# Altium schematic sheet Power_Board_DRV8323.SchDoc: MC Test Rig Power Board
size A4; Author: Ellen Wang; Organization: Waterloop; Address1: 200 University Ave W; Address2: Engineering 5, 1104; Address3: Waterloo, ON; Address4: N2LO 3G1; Revision: 1.0; SheetNumber: 1; SheetTotal: 2
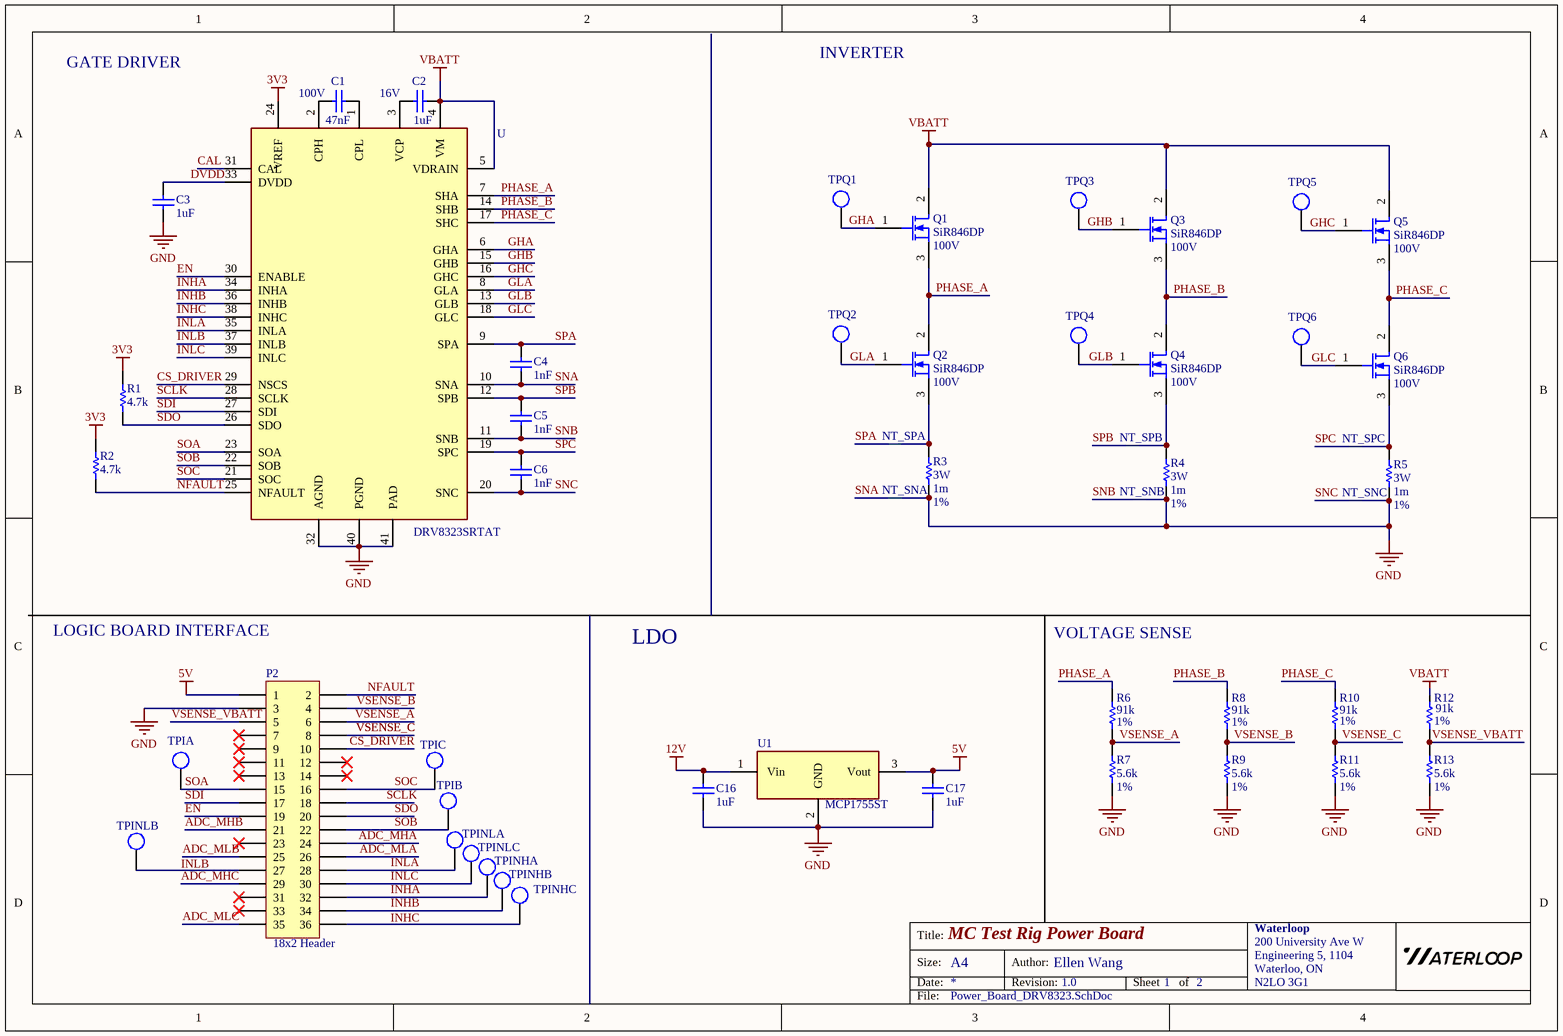
[diagram p0: Power_Board_DRV8323.SchDoc]

## Parts
C1  value 47nF  Rating: 100V  [0805 - Capacitor]  (hidden comment: Capacitor - Nonpolarized)
C2  value 1uF  Rating: 16V  [0805 - Capacitor]  (hidden comment: Capacitor - Nonpolarized)
C3  value 1uF  [0805 - Capacitor]  (hidden comment: Capacitor - Nonpolarized)
C4  value 1nF  [0805 - Capacitor]  (hidden comment: Capacitor - Nonpolarized)
C5  value 1nF  [0805 - Capacitor]  (hidden comment: Capacitor - Nonpolarized)
C6  value 1nF  [0805 - Capacitor]  (hidden comment: Capacitor - Nonpolarized)
C16  value 1uF  [0805 - Capacitor]  (hidden comment: Capacitor - Nonpolarized)
C17  value 1uF  [0805 - Capacitor]  (hidden comment: Capacitor - Nonpolarized)
NT_SNA  NetTie  [Net Tie]  (value not drawn)  (net tie, no BOM)
NT_SNB  NetTie  [Net Tie]  (value not drawn)  (net tie, no BOM)
NT_SNC  NetTie  [Net Tie]  (value not drawn)  (net tie, no BOM)
NT_SPA  NetTie  [Net Tie]  (value not drawn)  (net tie, no BOM)
NT_SPB  NetTie  [Net Tie]  (value not drawn)  (net tie, no BOM)
NT_SPC  NetTie  [Net Tie]  (value not drawn)  (net tie, no BOM)
P2  Header 18X2  [HDR2X18]  (value not drawn)
Q1  Supplier Part Number: SiR846DP  Rating: 100V  [PowerPAK® SO-8]  (hidden comment: MOSFET-N)
Q2  Supplier Part Number: SiR846DP  Rating: 100V  [PowerPAK® SO-8]  (hidden comment: MOSFET-N)
Q3  Supplier Part Number: SiR846DP  Rating: 100V  [PowerPAK® SO-8]  (hidden comment: MOSFET-N)
Q4  Supplier Part Number: SiR846DP  Rating: 100V  [PowerPAK® SO-8]  (hidden comment: MOSFET-N)
Q5  Supplier Part Number: SiR846DP  Rating: 100V  [PowerPAK® SO-8]  (hidden comment: MOSFET-N)
Q6  Supplier Part Number: SiR846DP  Rating: 100V  [PowerPAK® SO-8]  (hidden comment: MOSFET-N)
R1  value 4.7k  [0603 - Resistor]  (hidden comment: Resistor)
R2  value 4.7k  [0603 - Resistor]  (hidden comment: Resistor)
R3  value 1m  Rating: 3W  Tolerance: 1%  [2512 - RESISTOR]  (hidden comment: Resistor)
R4  value 1m  Rating: 3W  Tolerance: 1%  [2512 - RESISTOR]  (hidden comment: Resistor)
R5  value 1m  Rating: 3W  Tolerance: 1%  [2512 - RESISTOR]  (hidden comment: Resistor)
R6  value 91k  Tolerance: 1%  [0603 - Resistor]  (hidden comment: Resistor)
R7  value 5.6k  Tolerance: 1%  [0603 - Resistor]  (hidden comment: Resistor)
R8  value 91k  Tolerance: 1%  [0603 - Resistor]  (hidden comment: Resistor)
R9  value 5.6k  Tolerance: 1%  [0603 - Resistor]  (hidden comment: Resistor)
R10  value 91k  Tolerance: 1%  [0603 - Resistor]  (hidden comment: Resistor)
R11  value 5.6k  Tolerance: 1%  [0603 - Resistor]  (hidden comment: Resistor)
R12  value 91k  Tolerance: 1%  [0603 - Resistor]  (hidden comment: Resistor)
R13  value 5.6k  Tolerance: 1%  [0603 - Resistor]  (hidden comment: Resistor)
TPIA  Test Point  [Test Point]  (value not drawn)  (no BOM)
TPIB  Test Point  [Test Point]  (value not drawn)  (no BOM)
TPIC  Test Point  [Test Point]  (value not drawn)  (no BOM)
TPINHA  Test Point  [Test Point]  (value not drawn)  (no BOM)
TPINHB  Test Point  [Test Point]  (value not drawn)  (no BOM)
TPINHC  Test Point  [Test Point]  (value not drawn)  (no BOM)
TPINLA  Test Point  [Test Point]  (value not drawn)  (no BOM)
TPINLB  Test Point  [Test Point]  (value not drawn)  (no BOM)
TPINLC  Test Point  [Test Point]  (value not drawn)  (no BOM)
TPQ1  Test Point  [Test Point]  (value not drawn)  (no BOM)
TPQ2  Test Point  [Test Point]  (value not drawn)  (no BOM)
TPQ3  Test Point  [Test Point]  (value not drawn)  (no BOM)
TPQ4  Test Point  [Test Point]  (value not drawn)  (no BOM)
TPQ5  Test Point  [Test Point]  (value not drawn)  (no BOM)
TPQ6  Test Point  [Test Point]  (value not drawn)  (no BOM)
U  DRV8323SRTAT  [DRV8323SRTAT]
U1  MCP1755ST  [MCP1755ST]  (value not drawn)

## Nets
3V3: R1.2 R2.2 U.24(VREF)
5V: C17.2 P2.1 U1.3(Vout)
12V: C16.2 U1.1(Vin)
GND: C3.1 C16.1 C17.1 NT_SNA.2 NT_SNB.2 NT_SNC.2 P2.3 R3.1 R4.1 R5.1 R7.2 R9.2 R11.2 R13.2 U1.2(GND)
VBATT: C2.2 Q1.2(D) Q3.2(D) Q5.2(D) R12.1 U.4(VM) U.5(VDRAIN)
ADC_MHA: P2.24
ADC_MHB: P2.21
ADC_MHC: P2.29
ADC_MLA: P2.26
ADC_MLB: P2.25
ADC_MLC: P2.35
CAL: U.31(CAL)
CS_DRIVER: P2.10 U.29(NSCS)
DVDD: C3.2 U.33(DVDD)
EN: P2.19 U.30(ENABLE)
GHA: Q1.1(G) TPQ1.1 U.6(GHA)
GHB: Q3.1(G) TPQ3.1 U.15(GHB)
GHC: Q5.1(G) TPQ5.1 U.16(GHC)
GLA: Q2.1(G) TPQ2.1 U.8(GLA)
GLB: Q4.1(G) TPQ4.1 U.13(GLB)
GLC: Q6.1(G) TPQ6.1 U.18(GLC)
INHA: P2.32 TPINHA.1 U.34(INHA)
INHB: P2.34 TPINHB.1 U.36(INHB)
INHC: U.38(INHC)
INLA: P2.28 TPINLA.1 U.35(INLA)
INLB: U.37(INLB)
INLC: P2.30 TPINLC.1 U.39(INLC)
NFAULT: P2.2 R2.1 U.25(NFAULT)
PHASE_A: Q1.3(S) Q2.2(D) R6.1 U.7(SHA)
PHASE_B: Q3.3(S) Q4.2(D) R8.1 U.14(SHB)
PHASE_C: Q5.3(S) Q6.2(D) R10.1 U.17(SHC)
SCLK: P2.18 U.28(SCLK)
SDI: P2.17 U.27(SDI)
SDO: P2.20 R1.1 U.26(SDO)
SNA: C4.1 NT_SNA.1 U.10(SNA)
SNB: C5.1 NT_SNB.1 U.11(SNB)
SNC: C6.1 NT_SNC.1 U.20(SNC)
SOA: P2.15 TPIA.1 U.23(SOA)
SOB: P2.22 TPIB.1 U.22(SOB)
SOC: P2.16 TPIC.1 U.21(SOC)
SPA: C4.2 NT_SPA.1 U.9(SPA)
SPB: C5.2 NT_SPB.1 U.12(SPB)
SPC: C6.2 NT_SPC.1 U.19(SPC)
VSENSE_A: P2.6 R6.2 R7.1
VSENSE_B: P2.4 R8.2 R9.1
VSENSE_C: P2.8 R10.2 R11.1
VSENSE_VBATT: P2.5 R12.2 R13.1
NetC1_1: C1.1 U.2(CPH)
NetC1_2: C1.2 U.1(CPL)
NetC2_1: C2.1 U.3(VCP)
NetNT_SPA_2: NT_SPA.2 Q2.3(S) R3.2
NetNT_SPB_2: NT_SPB.2 Q4.3(S) R4.2
NetNT_SPC_2: NT_SPC.2 Q6.3(S) R5.2
NetP2_27: P2.27 TPINLB.1
NetP2_36: P2.36 TPINHC.1
NetU_32: U.32(AGND) U.40(PGND) U.41(PAD)

Not connected (* = marked no-connect by the designer): P2 7* 9* 11* 12* 13* 14* 23* 31* 33*

## Notes on the sheet
- GATE DRIVER
- INVERTER
- LOGIC BOARD INTERFACE
- LDO
- VOLTAGE SENSE
- (near P2) 18x2 Header
- Labels drawn without touching a wire or pin: GND, INHC, INLB
- Title:
- Size:
- Date:
- A4
- Author:
- Revision:
- Sheet
- of
- File:

## Library data of the parts
C1 = Capacitor - Nonpolarized: Nonpolarized Capacitor; Manufacturer: YAGEO; Manufacturer Part Number: CC0805KKX7R0BB473; Supplier Part Number: 311-1876-1-ND; Supplier: Digikey
C2 = Capacitor - Nonpolarized: Nonpolarized Capacitor; Manufacturer: YAGEO; Manufacturer Part Number: CC0805KKX7R7BB105; Supplier Part Number: 311-1365-1-ND; Supplier: Digikey; Parameter 1: *
C3 = Capacitor - Nonpolarized: Nonpolarized Capacitor; Manufacturer: YAGEO; Manufacturer Part Number: CC0805KKX7R7BB105; Rating: 16V; Supplier Part Number: 311-1365-1-ND; Supplier: Digikey
C4-C6 = Capacitor - Nonpolarized: Nonpolarized Capacitor; Manufacturer: YAGEO; Manufacturer Part Number: CC0805KRX7R0BB102; Rating: 100V; Supplier Part Number: 311-1472-1-ND; Supplier: Digikey
C16 C17 = Capacitor - Nonpolarized: Nonpolarized Capacitor; Supplier Part Number: *; Supplier: *; Manufacturer: *; Rating: *; Manufacturer Part Number: *
NT_SNA NT_SNB NT_SNC NT_SPA NT_SPB NT_SPC = Net Tie
P2 = Header 18X2: Header, 18-Pin, Dual row; LatestRevisionDate: 17-Jul-2002; LatestRevisionNote: Re-released for DXP Platform.; Publisher: Altium Limited
Q1-Q6 = MOSFET-N: N-Channel MOSFET; Supplier: *; Manufacturer Part Number: *; Manufacturer: *; Value: *
R1 R2 = Resistor: Manufacturer Part Number: RC0603FR-074K7L; Manufacturer: YAGEO; Rating: *; Supplier Part Number: 311-4.70KHRCT-ND; Supplier: Digikey
R3-R5 = Resistor: Manufacturer Part Number: CSR2512C0R001F; Manufacturer: Riedon; Supplier Part Number: 696-1185-1-ND; Supplier: Digikey
R6 R8 R10 R12 = Resistor: Manufacturer Part Number: RC0603FR-0791KL; Manufacturer: YAGEO; Supplier Part Number: 311-91.0KHRCT-ND; Supplier: Digikey
R7 R9 R11 R13 = Resistor: Manufacturer Part Number: RC0603FR-075K6L; Manufacturer: YAGEO; Rating: *; Supplier Part Number: 311-5.60KHRCT-ND; Supplier: Digikey
U = DRV8323SRTAT: Multiphase Motor Driver Power MOSFET SPI; Manufacturer: Texas Instruments; Manufacturer Part Number: DRV8323SRTAT; Supplier: Digikey; Supplier Part Number: 296-47095-1-ND; ComponentLink1Description: Datasheet; ComponentLink1URL: https://www.ti.com/lit/ds/symlink/drv8323.pdf?HQS=dis-dk-null-digikeymode-dsf-pf-null-wwe&ts=1623708117864